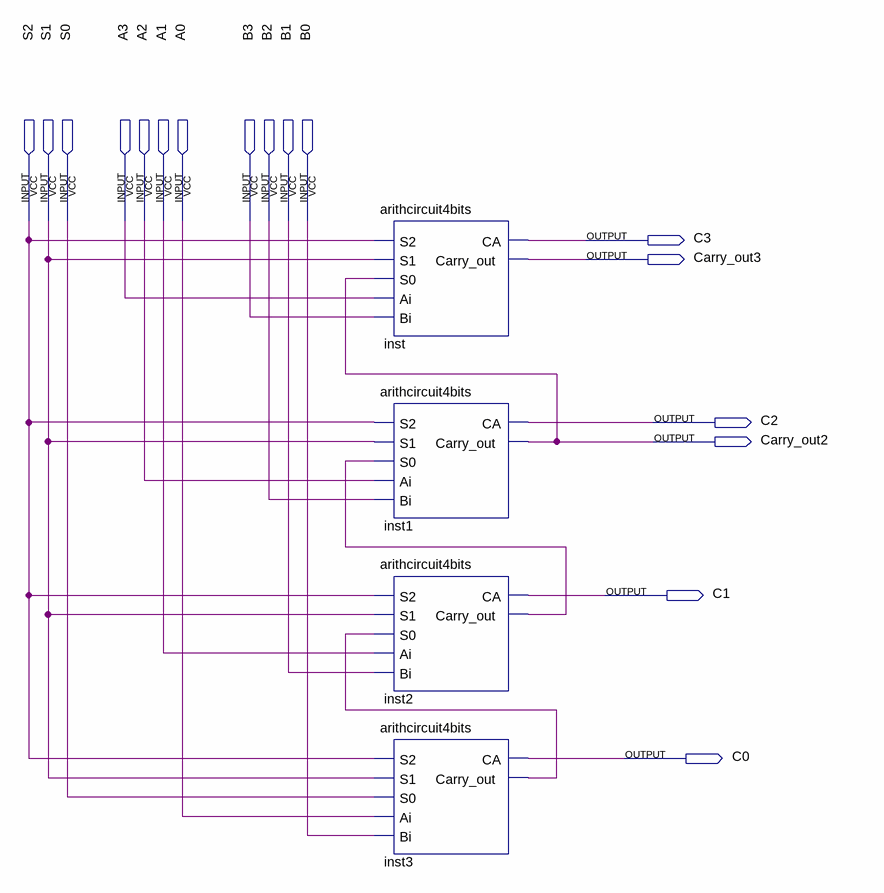
[diagram p0: schematic sheet]
// Quartus schematic lab3.bdf as structural Verilog: 4 symbols, 17 pins
module lab3 (
  input  S2,
  input  S1,
  input  S0,
  input  A3,
  input  A2,
  input  A1,
  input  A0,
  input  B3,
  input  B2,
  input  B1,
  input  B0,
  output C3,
  output Carry_out3,
  output C2,
  output Carry_out2,
  output C1,
  output C0
);

  wire inst2_carry_out, inst3_carry_out;

  arithcircuit4bits inst (.S2(S2), .S1(S1), .S0(Carry_out2), .Ai(A3), .Bi(B3), .CA(C3), .Carry_out(Carry_out3));
  arithcircuit4bits inst1 (.S2(S2), .S1(S1), .S0(inst2_carry_out), .Ai(A2), .Bi(B2), .CA(C2), .Carry_out(Carry_out2));
  arithcircuit4bits inst2 (
    .S2(S2), .S1(S1), .S0(inst3_carry_out), .Ai(A1), .Bi(B1), .CA(C1), .Carry_out(inst2_carry_out));
  arithcircuit4bits inst3 (.S2(S2), .S1(S1), .S0(S0), .Ai(A0), .Bi(B0), .CA(C0), .Carry_out(inst3_carry_out));
endmodule
